# EAGLE design bt_441 (EAGLE 6.5.0)
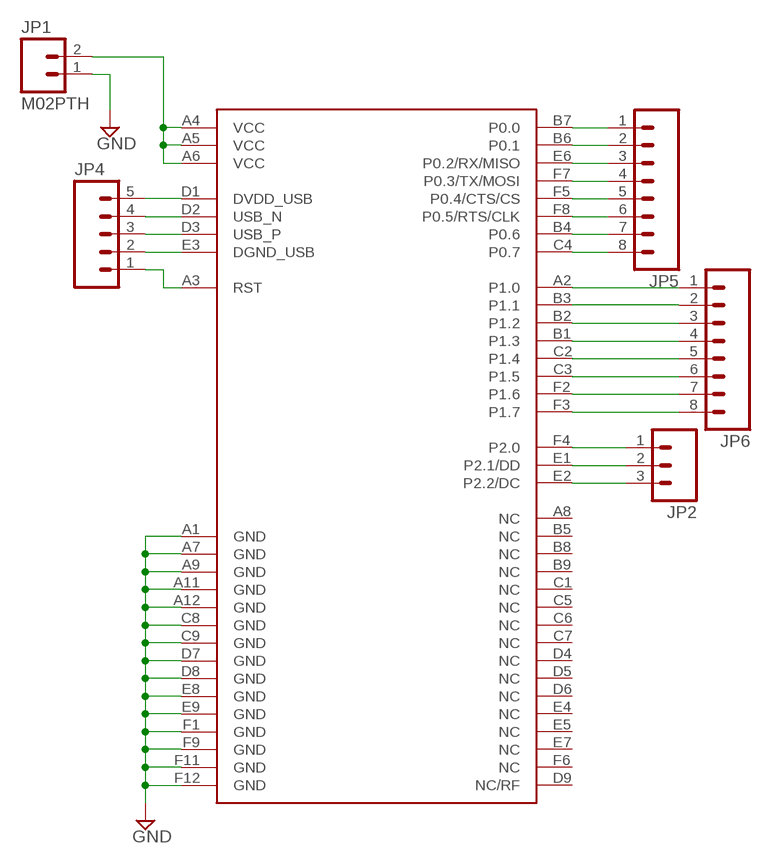
[diagram p0: schematic, sheet 1]

## Parts
JP1  M02PTH  [1X02]
JP2  M03PTH  [1X03]
JP4  M05PTH  [1X05]
JP5  M081X08  [1X08]
JP6  M081X08  [1X08]
U$1  PAN1720  [PAN1720]

## Nets
GND: JP1.1 U$1.A1(GND) U$1.A7(GND) U$1.A9(GND) U$1.A11(GND) U$1.A12(GND) U$1.C8(GND) U$1.C9(GND) U$1.D7(GND) U$1.D8(GND) U$1.E8(GND) U$1.E9(GND) U$1.F1(GND) U$1.F9(GND) U$1.F11(GND) U$1.F12(GND)
N$1: JP1.2 U$1.A4(VCC) U$1.A5(VCC) U$1.A6(VCC)
N$2: JP4.5 U$1.D1(DVDD_USB)
N$3: JP4.4 U$1.D2(USB_N)
N$4: JP4.3 U$1.D3(USB_P)
N$5: JP4.2 U$1.E3(DGND_USB)
N$6: JP4.1 U$1.A3(RST)
N$7: JP5.1 U$1.B7(P0.0)
N$8: JP5.2 U$1.B6(P0.1)
N$9: JP5.3 U$1.E6(P0.2/RX/MISO)
N$10: JP5.4 U$1.F7(P0.3/TX/MOSI)
N$11: JP5.5 U$1.F5(P0.4/CTS/CS)
N$12: JP5.6 U$1.F8(P0.5/RTS/CLK)
N$13: JP5.7 U$1.B4(P0.6)
N$14: JP5.8 U$1.C4(P0.7)
N$15: JP6.1 U$1.A2(P1.0)
N$16: JP6.2 U$1.B3(P1.1)
N$17: JP6.3 U$1.B2(P1.2)
N$18: JP6.4 U$1.B1(P1.3)
N$19: JP6.5 U$1.C2(P1.4)
N$20: JP6.6 U$1.C3(P1.5)
N$21: JP6.7 U$1.F2(P1.6)
N$22: JP6.8 U$1.F3(P1.7)
N$23: JP2.1 U$1.F4(P2.0)
N$24: JP2.2 U$1.E1(P2.1/DD)
N$25: JP2.3 U$1.E2(P2.2/DC)
Unconnected: U$1.A8(NC) U$1.B5(NC) U$1.B8(NC) U$1.B9(NC) U$1.C1(NC) U$1.C5(NC) U$1.C6(NC) U$1.C7(NC) U$1.D4(NC) U$1.D5(NC) U$1.D6(NC) U$1.D9(NC/RF) U$1.E4(NC) U$1.E5(NC) U$1.E7(NC) U$1.F6(NC)

## Library data of the parts
JP1 = SparkFun-Connectors:M02: Standard 2-pin 0.1" header. Use with - straight break away headers ( PRT-00116) - right angle break away headers (PRT-00553) - swiss pins (PRT-00743) - machine pins (PRT-00117) - female headers (PRT-00115) Molex polarized connector foot print use with: PRT-08233 with associated crimp pins and housings. 2.54_SCREWTERM for use with PRT-10571. 3.5mm Screw Terminal footprints for PRT-08084 5mm Screw Terminal footprints for use with PRT-08433
JP2 = SparkFun-Connectors:M03: Header 3 Standard 3-pin 0.1" header. Use with straight break away headers (SKU : PRT-00116), right angle break away headers (PRT-00553), swiss pins (PRT-00743), machine pins (PRT-00117), and female headers (PRT-00115). Molex polarized connector foot print use with SKU : PRT-08232 with associated crimp pins and housings.
JP4 = SparkFun-Connectors:M05: Header 5 Standard 5-pin 0.1" header. Use with straight break away headers (SKU : PRT-00116), right angle break away headers (PRT-00553), swiss pins (PRT-00743), machine pins (PRT-00117), and female headers (PRT-00115). Molex polarized connector foot print use with SKU : PRT-08230 with associated crimp pins and housings.
JP5 JP6 = SparkFun-Connectors:M08: Header 8 Standard 8-pin 0.1" header. Use with straight break away headers (SKU : PRT-00116), right angle break away headers (PRT-00553), swiss pins (PRT-00743), machine pins (PRT-00117), and female headers (PRT-00115).
U$1 = TuansLib:PAN1720

## Board
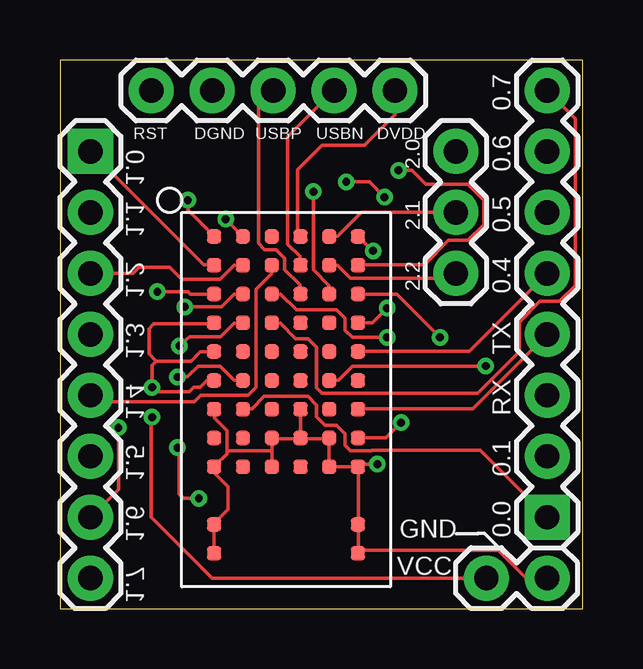
[diagram p1: board, top side]
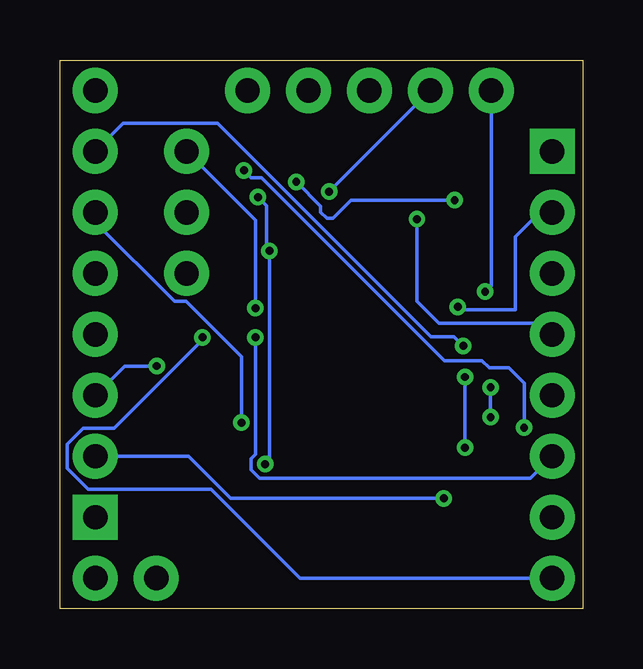
[diagram p2: board, bottom side, seen from below]

Size 21.79 x 22.86 mm. Coordinates in mm from the lower left corner, seen from the top.
Outline: 0,0 21.79,0 21.79,22.86 0,22.86 0,0
Copper layers (1*16): Top 0.035mm / dielectric 1.5mm / Bottom 0.035mm
Design rules "default *": minimum track width 6mil, minimum drill 13mil, track to track 6mil, track to pad 6mil, pad to pad 6mil, via to via 6mil, smd to smd 6mil, copper to edge 15mil, drill to drill 8mil, minimum pad ring 8mil, minimum via ring 7mil, stop-mask expansion 3mil, vias tented up to drill 0mil, thermal gap 10mil

### Footprints (pad centres in the part's own frame; a part is rotated, then mirrored left to right if it is on the bottom)
1X02 = drill 1.016 pad 1.88: 1 0,0; 2 2.54,0
1X03 = drill 1.016 pad 1.88: 1 0,0; 2 2.54,0; 3 5.08,0
1X05 = drill 1.016 pad 1.88: 1 0,0; 2 2.54,0; 3 5.08,0; 4 7.62,0; 5 10.16,0
1X08 = drill 1.016 pad 1.88 square: 1 0,0 | drill 1.016 pad 1.88: 2 2.54,0; 3 5.08,0; 4 7.62,0; 5 10.16,0; 6 12.7,0; 7 15.24,0; 8 17.78,0
PAN1720 = smd 0.6 x 0.6: A1 1,1.35; A2 2.2,1.35; A3 3.4,1.35; A4 4.6,1.35; A5 5.8,1.35; A6 7,1.35; A7 8.2,1.35; A8 9.4,1.35; A9 10.6,1.35; A11 13,1.35; A12 14.2,1.35; B1 1,2.55; B2 2.2,2.55; B3 3.4,2.55; B4 4.6,2.55; B5 5.8,2.55; B6 7,2.55; B7 8.2,2.55; B8 9.4,2.55; B9 10.6,2.55; C1 1,3.75; C2 2.2,3.75; C3 3.4,3.75; C4 4.6,3.75; C5 5.8,3.75; C6 7,3.75; C7 8.2,3.75; C8 9.4,3.75; C9 10.6,3.75; D1 1,4.95; D2 2.2,4.95; D3 3.4,4.95; D4 4.6,4.95; D5 5.8,4.95; D6 7,4.95; D7 8.2,4.95; D8 9.4,4.95; D9 10.6,4.95; E1 1,6.15; E2 2.2,6.15; E3 3.4,6.15; E4 4.6,6.15; E5 5.8,6.15; E6 7,6.15; E7 8.2,6.15; E8 9.4,6.15; E9 10.6,6.15; F1 1,7.35; F2 2.2,7.35; F3 3.4,7.35; F4 4.6,7.35; F5 5.8,7.35; F6 7,7.35; F7 8.2,7.35; F8 9.4,7.35; F9 10.6,7.35; F11 13,7.35; F12 14.2,7.35; P$2 1,1.35; P$29 1,4.95

### Placement (x,y rotation side)
JP1  20.32,1.27 180 top
JP2  16.51,19.05 270 top
JP4  3.81,21.59 0 top
JP5  20.32,3.81 90 top
JP6  1.27,19.05 270 top
U$1  5.08,16.51 270 top

### Tracks (layer width: path | path; a pad name or v marks a point on that pad's centre or on a via)
GND  (via drill 0.33)
  Top 0.152: U$1.A12 U$1.A11 6.45,3.58 7.01,4.14 7.01,5.08 6.45,5.64 6.45,5.89 U$1.A9 6.48,5.97 6.96,6.45 6.96,6.58 | 6.96,6.58 6.96,7.42 6.45,7.92 6.45,8.31 U$1.A7 | 8.84,6.58 8.84,7.09 U$1.C8 8.91,7.09 10.01,7.09 U$1.D8 | 8.84,6.58 U$1.C9 | U$1.D7 10.03,7.16 U$1.D8 | U$1.F9 11.3,5.92 U$1.E9 11.23,7.09 U$1.E8 11.15,7.09 10.08,7.09 U$1.D8 | U$1.F1 13.03,14.91 v13.06,14.91 | v13.23,6.02 12.57,6.02 12.5,5.94 U$1.F9 | U$1.F9 12.45,5.84 12.45,3.58 U$1.F11 12.45,3.5 12.45,2.31 U$1.F12 12.5,2.44 18.29,2.44 19.46,1.27 JP1.1 | 8.84,6.58 6.96,6.58 | U$1.A1 5.33,16.61 v5.33,17.02 | v11.94,17.78 12.9,17.78 v13.54,17.14
  Bottom 0.152: v13.23,6.02 13.06,6.2 v13.06,14.91 13.18,15.04 13.18,16.79 v13.54,17.14 | v5.33,17.02 9.65,17.02 10.41,16.26 10.67,16.26 10.92,16.51 10.92,16.76 v11.94,17.78
N$1  (via drill 0.33)
  Top 0.152: U$1.A4 6.38,11.86 3.91,11.86 3.71,11.66 3.71,10.62 4.01,10.31 | 4.01,10.31 5.46,10.31 5.84,10.69 6.41,10.69 U$1.A5 | U$1.A6 6.13,9.51 5.84,9.22 5.56,9.22 5.38,9.04 4.01,9.04 v3.83,9.22 3.83,10.13 4.01,10.31 | JP1.2 6.35,1.27 3.81,3.81 3.81,7.95 v3.83,7.98
  Bottom 0.152: v3.83,7.98 v3.83,9.22
N$2
  Top 0.152: U$1.D1 9.91,15.63 9.91,18.29 10.92,19.3 12.7,19.3 13.97,20.57 JP4.5
N$3
  Top 0.152: JP4.4 9.5,19.66 9.5,15.19 10.01,14.68 10.01,14.33 U$1.D2
N$4
  Top 0.152: JP4.3 8.28,20.98 8.28,15.21 8.53,14.96 9.02,14.96 9.37,14.61 9.37,14.12 10.01,13.49 10.01,13.13 U$1.D3
N$5  (via drill 0.33)
  Top 0.152: v10.57,17.37 10.57,14.12 11.23,13.46 11.23,13.13 U$1.E3
  Bottom 0.152: JP4.2 v10.57,17.37
N$6  (via drill 0.33)
  Top 0.152: U$1.A3 5.43,13.11 5.33,13.21 v4.06,13.21
  Bottom 0.152: v4.06,13.21 3.81,13.46 JP4.1
N$7
  Top 0.152: JP5.1 17.53,6.6 13.01,6.6 12.98,6.58 12.12,6.58 11.89,6.81 11.89,7.29 11.53,7.64 11.05,7.64 10.69,8 10.69,8.48 10.34,8.84 8.51,8.84 8,8.33 7.64,8.33 U$1.B7
N$8  (via drill 0.33)
  Top 0.152: U$1.B6 7.62,9.53 7.26,9.53 6.68,10.11 5.77,10.11 5.31,9.65 v4.9,9.65 | v4.9,6.71 4.98,6.63 4.98,4.78 5.16,4.6 v5.79,4.6
  Bottom 0.152: JP5.2 16.43,6.35 14.68,4.6 v5.79,4.6 | v4.9,9.65 v4.9,6.71
N$9  (via drill 0.33)
  Top 0.152: v17.75,10.11 12.19,10.11 11.61,9.53 11.25,9.53 U$1.E6
  Bottom 0.152: v17.75,10.11 19.1,10.11 JP5.3
N$10
  Top 0.152: JP5.4 17.22,8.33 12.45,8.33 U$1.F7
N$11
  Top 0.152: JP5.5 17.07,10.72 12.45,10.72 U$1.F5
N$12  (via drill 0.33)
  Top 0.152: v14.22,7.75 13.59,7.11 12.45,7.11 U$1.F8
  Bottom 0.152: v14.22,7.75 14.22,10.49 16.54,12.8 17.02,12.8 20.32,16.1 JP5.6
N$13  (via drill 0.33)
  Top 0.152: U$1.B4 7.62,11.89 7.26,11.89 6.71,11.33 5.41,11.33 v4.98,10.95
  Bottom 0.152: JP5.7 19.15,20.22 15.21,20.22 6.33,11.33 5.36,11.33 v4.98,10.95
N$14
  Top 0.152: JP5.8 21.49,20.42 21.49,13.46 20.83,12.8 20.02,12.8 19.15,11.94 19.15,10.69 17.42,8.97 10.92,8.97 10.69,9.2 10.69,10.9 10.34,11.25 9.83,11.25 9.2,11.89 8.84,11.89 U$1.C4
N$15
  Top 0.152: JP6.1 5.99,14.33 6.43,14.33 U$1.A2
N$16  (via drill 0.33)
  Top 0.152: v5.21,12.57 6.73,12.57 7.26,13.11 U$1.B3
  Bottom 0.152: v5.21,12.57 5.08,12.45 2.79,12.45 2.79,15.49 1.78,16.51 JP6.2
N$17
  Top 0.152: U$1.B2 7.26,14.3 6.68,13.72 5.08,13.72 4.57,14.22 3.3,14.22 3.05,13.97 JP6.3
N$18  (via drill 0.33)
  Top 0.152: v6.91,16.23 U$1.B1
  Bottom 0.152: v6.91,16.23 6.91,12.8 5.99,11.89 1.73,11.89 JP6.4
N$19
  Top 0.152: U$1.C2 8.81,14.3 8.81,13.95 8.18,13.31 8.18,9.22 7.85,8.89 5.87,8.89 5.59,8.61 1.55,8.61 JP6.5
N$20  (via drill 0.33)
  Top 0.152: v13.64,11.3 12.19,11.3 11.89,11.61 11.89,12.09 11.53,12.45 9.86,12.45 9.2,13.11 U$1.C3
  Bottom 0.152: v13.64,11.3 13.64,6.43 13.82,6.25 13.82,5.79 13.46,5.44 2.18,5.44 JP6.6
N$21  (via drill 0.33)
  Top 0.152: v2.44,7.54 2.44,4.98 JP6.7 | U$1.F2 12.45,14.33 15.19,14.33 16.2,15.34 17.02,15.34 17.68,16 17.68,17.02 17.02,17.68 15.27,17.68 14.68,18.26 v14.12,18.26
  Bottom 0.152: v14.12,18.26 13.82,17.96 13.39,17.96 5.77,10.34 4.19,10.34 3.89,10.03 3.07,10.03 2.44,9.4 v2.44,7.54
N$22  (via drill 0.33)
  Top 0.152: v15.85,11.3 14.05,13.11 12.45,13.11 U$1.F3
  Bottom 0.152: v15.85,11.3 15.85,11.2 19.53,7.52 20.83,7.52 21.49,6.86 21.49,5.84 20.62,4.98 15.49,4.98 11.79,1.27 JP6.8
N$23  (via drill 0.33)
  Top 0.152: v13.64,12.52 13.03,11.91 12.45,11.91 U$1.F4
  Bottom 0.152: v13.64,12.52 13.64,16.18 JP2.1
N$24
  Top 0.152: JP2.2 12.57,16.51 11.58,15.52 11.25,15.52 U$1.E1
N$25
  Top 0.152: JP2.3 16.31,13.77 12.12,13.77 11.58,14.3 11.25,14.3 U$1.E2

### Text on the board
tNames: 0.7 | RST | DGND | USBP | USBN | DVDD | 1.0 | 2.0 | 0.6 | 1.1 | 2.1 | 0.5 | 1.2 | 2.2 | 0.4 | 1.3 | TX | 1.4 | RX | 1.5 | 0.1 | 1.6 | GND | 0.0 | 1.7 | VCC